# EAGLE design BigDigit (EAGLE 7.1.0)
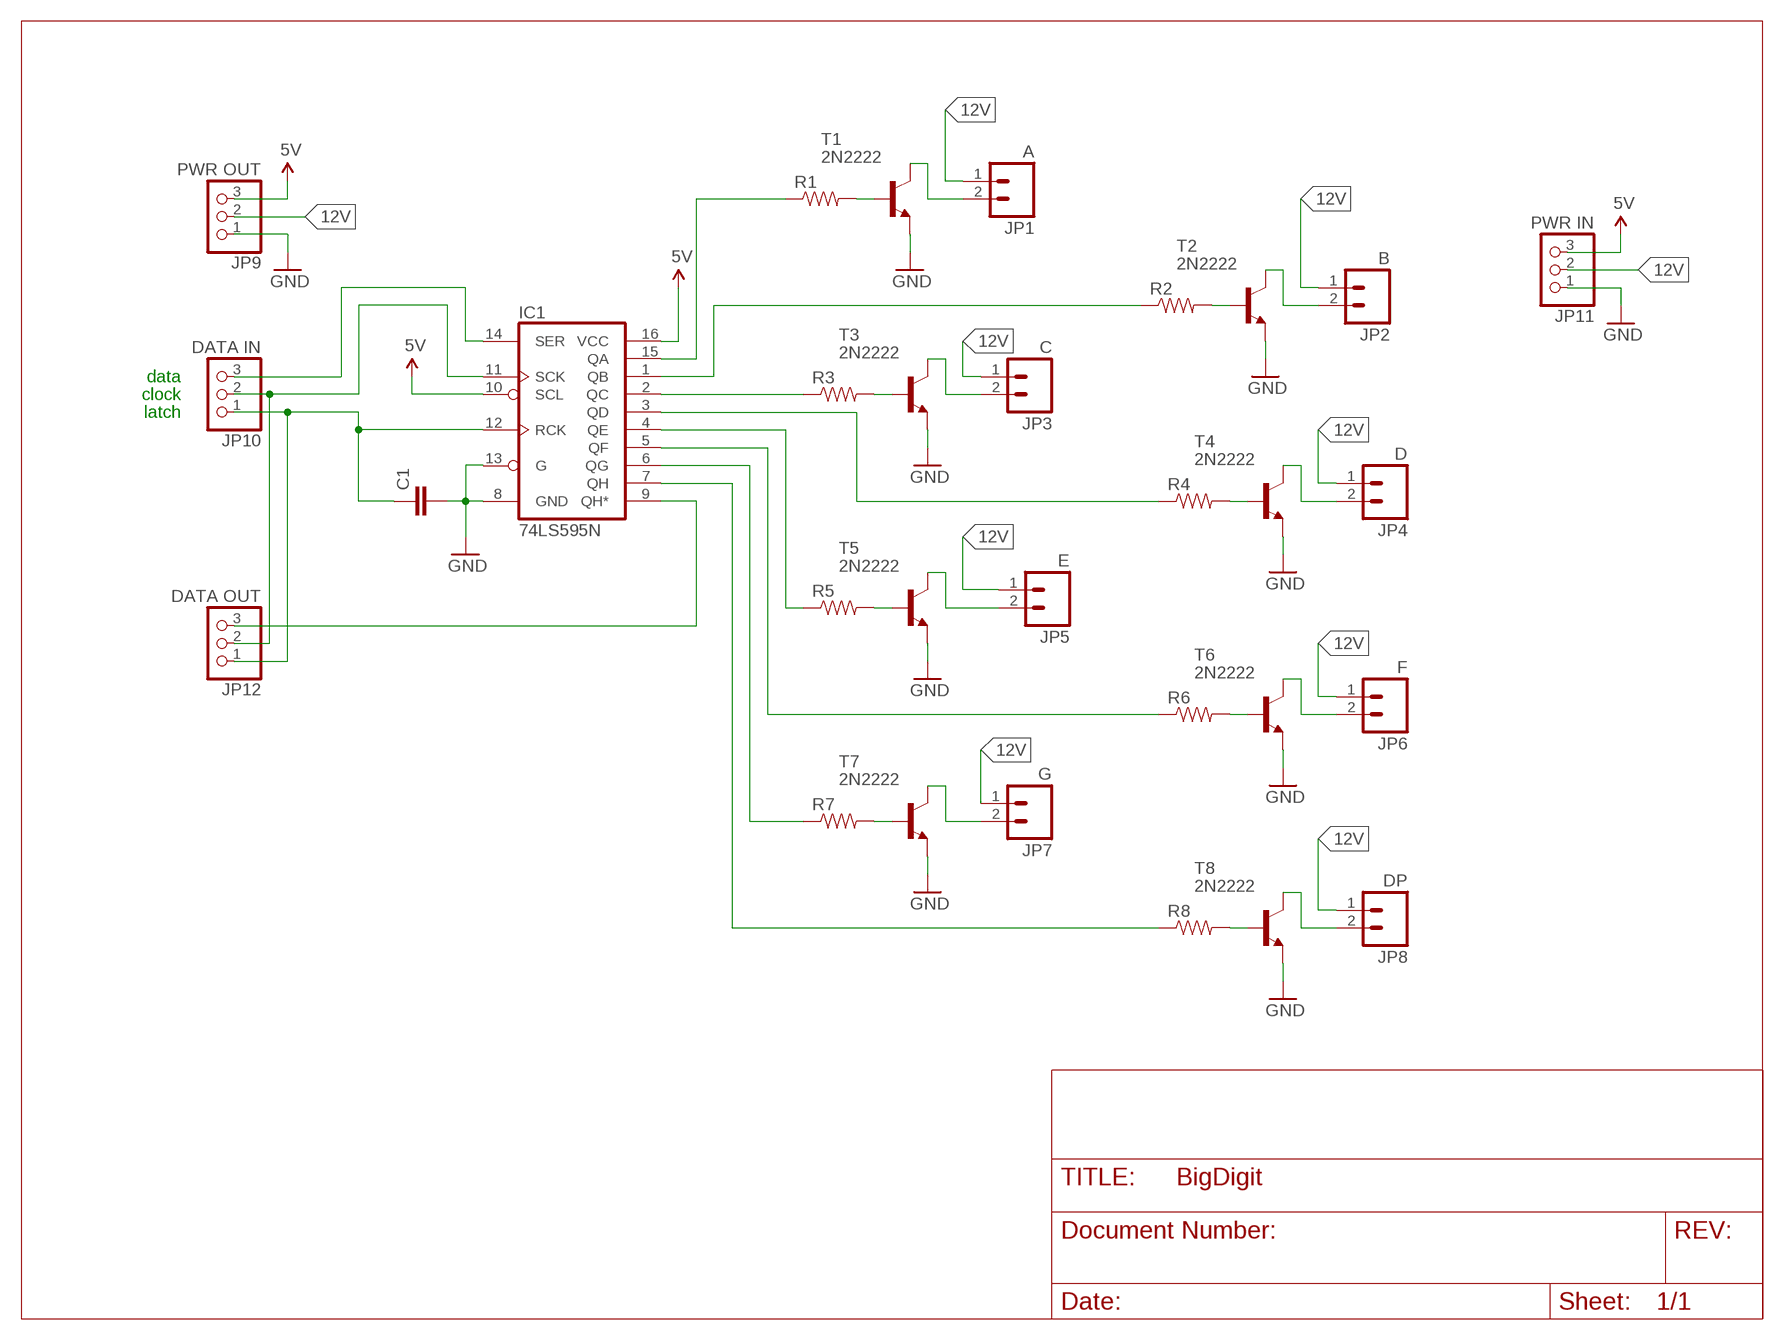
[diagram p0: schematic, sheet 1]

## Parts
C1  0.1UF-50V-20%(PTH)KIT-EZ  [CAP-PTH-SMALL-KIT]
IC1  74LS595N  [DIL16]
JP1  A  M02PTH  [1X02]
JP2  B  M02PTH  [1X02]
JP3  C  M02PTH  [1X02]
JP4  D  M02PTH  [1X02]
JP5  E  M02PTH  [1X02]
JP6  F  M02PTH  [1X02]
JP7  G  M02PTH  [1X02]
JP8  DP  M02PTH  [1X02]
JP9  PWR OUT  PINHD-1X3CB  [1X03-CLEANBIG]
JP10  DATA IN  PINHD-1X3CB  [1X03-CLEANBIG]
JP11  PWR IN  PINHD-1X3CB  [1X03-CLEANBIG]
JP12  DATA OUT  PINHD-1X3CB  [1X03-CLEANBIG]
R1  RESISTORPTH-1/4W-VERT  [AXIAL-0.1]
R2  RESISTORPTH-1/4W-VERT  [AXIAL-0.1]
R3  RESISTORPTH-1/4W-VERT  [AXIAL-0.1]
R4  RESISTORPTH-1/4W-VERT  [AXIAL-0.1]
R5  RESISTORPTH-1/4W-VERT  [AXIAL-0.1]
R6  RESISTORPTH-1/4W-VERT  [AXIAL-0.1]
R7  RESISTORPTH-1/4W-VERT  [AXIAL-0.1]
R8  RESISTORPTH-1/4W-VERT  [AXIAL-0.1]
T1  2N2222  [TO92-EBC-OVAL]
T2  2N2222  [TO92-EBC-OVAL]
T3  2N2222  [TO92-EBC-OVAL]
T4  2N2222  [TO92-EBC-OVAL]
T5  2N2222  [TO92-EBC-OVAL]
T6  2N2222  [TO92-EBC-OVAL]
T7  2N2222  [TO92-EBC-OVAL]
T8  2N2222  [TO92-EBC-OVAL]

## Nets
5V: IC1.10(SCL) IC1.16(VCC) JP9.3 JP11.3
12V: JP1.1 JP2.1 JP3.1 JP4.1 JP5.1 JP6.1 JP7.1 JP8.1 JP9.2 JP11.2
GND: C1.2 IC1.8(GND) IC1.13(G) JP9.1 JP11.1 T1.E T2.E T3.E T4.E T5.E T6.E T7.E T8.E
N$1: IC1.15(QA) R1.P$1
N$2: R1.P$2 T1.B
N$4: R5.P$2 T5.B
N$5: R3.P$2 T3.B
N$6: JP3.2 T3.C
N$7: JP5.2 T5.C
N$8: R7.P$2 T7.B
N$9: JP7.2 T7.C
N$10: IC1.1(QB) R2.P$1
N$11: R2.P$2 T2.B
N$12: JP2.2 T2.C
N$13: R4.P$2 T4.B
N$14: JP4.2 T4.C
N$15: R6.P$2 T6.B
N$16: JP6.2 T6.C
N$17: R8.P$2 T8.B
N$18: JP8.2 T8.C
N$19: IC1.2(QC) R3.P$1
N$20: IC1.3(QD) R4.P$1
N$21: IC1.4(QE) R5.P$1
N$22: IC1.5(QF) R6.P$1
N$23: IC1.6(QG) R7.P$1
N$24: IC1.7(QH) R8.P$1
N$25: JP1.2 T1.C
N$26: IC1.14(SER) JP10.3
N$27: IC1.11(SCK) JP10.2 JP12.2
N$28: C1.1 IC1.12(RCK) JP10.1 JP12.1
N$29: IC1.9(QH*) JP12.3

## Notes on the sheet
- data
- clock
- latch

## Library data of the parts
C1 = SparkFun-Capacitors:0.1UF-50V-20%(PTH): CAP-08370; PROD_ID: CAP-08370
IC1 = SparkFun-DigitalIC:74*595: 8-bit SHIFT REGISTER, output latch
JP1-JP8 = SparkFun-Connectors:M02: Standard 2-pin 0.1" header. Use with - straight break away headers ( PRT-00116) - right angle break away headers (PRT-00553) - swiss pins (PRT-00743) - machine pins (PRT-00117) - female headers (PRT-00115) Molex polarized connector foot print use with: PRT-08233 with associated crimp pins and housings. 2.54_SCREWTERM for use with PRT-10571. 3.5mm Screw Terminal footprints for PRT-08084 5mm Screw Terminal footprints for use with PRT-08433
JP9-JP12 = adafruit:PINHD-1X3: PIN HEADER
R1-R8 = SparkFun-Resistors:RESISTOR: Resistor Basic schematic elements and footprints for 0603, 1206, and PTH resistors.
T1-T8 = adafruit:2N2222: NPN TRANSISTOR Big oval pads

## Board
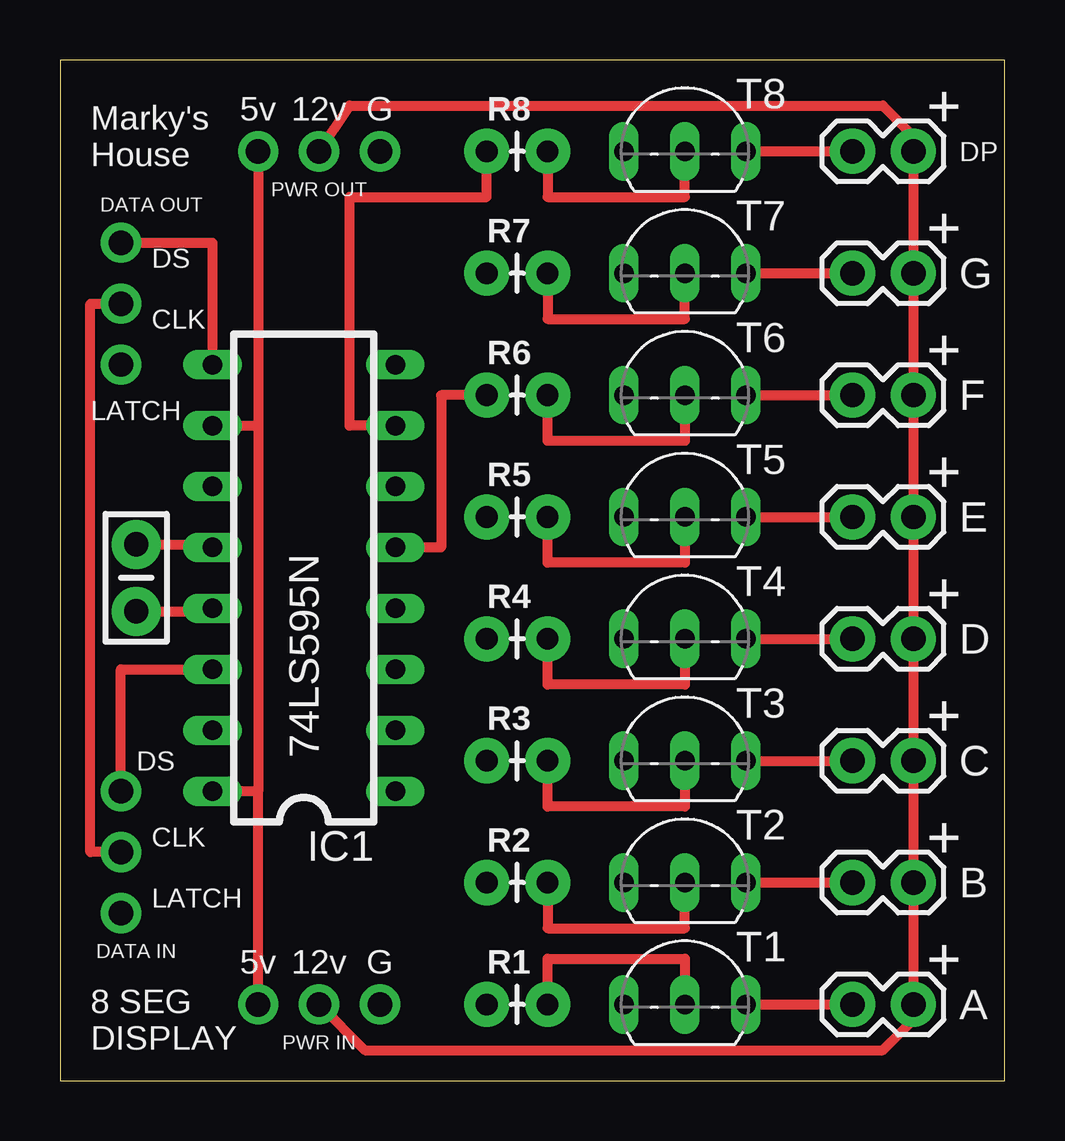
[diagram p1: board, top side]
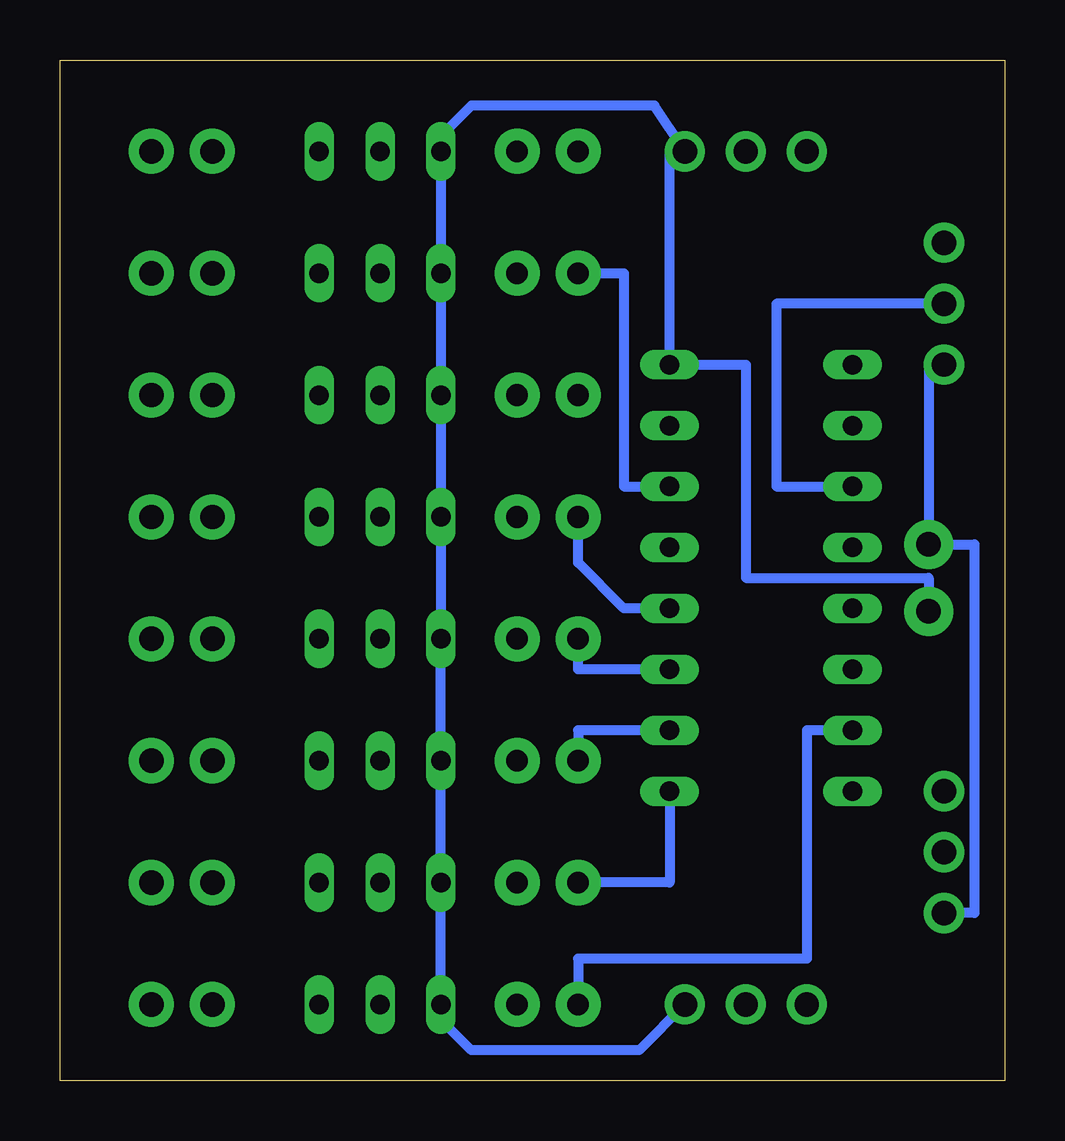
[diagram p2: board, bottom side, seen from below]

Size 39.37 x 42.55 mm. Coordinates in mm from the lower left corner, seen from the top.
Outline: 0,0 39.37,0 39.37,42.55 0,42.55 0,0
Copper layers (1*16): Top 0.0356mm / dielectric 1.5011mm / Bottom 0.0356mm
Design rules "LaenPCBOrder": minimum track width 6mil, minimum drill 13mil, track to track 6mil, track to pad 6mil, pad to pad 6mil, via to via 6mil, smd to smd 6mil, copper to edge 15mil, drill to drill 6mil, minimum pad ring 7mil, minimum via ring 7mil, stop-mask expansion 3mil, vias tented up to drill 0mil, thermal gap 10mil

### Footprints (pad centres in the part's own frame; a part is rotated, then mirrored left to right if it is on the bottom)
CAP-PTH-SMALL-KIT = drill 1.016 pad 2.032: 1 -1.397,0; 2 1.397,0
DIL16 = drill 0.813 long: 1 -8.89,-3.81; 2 -6.35,-3.81; 3 -3.81,-3.81; 4 -1.27,-3.81; 5 1.27,-3.81; 6 3.81,-3.81; 7 6.35,-3.81; 8 8.89,-3.81; 9 8.89,3.81; 10 6.35,3.81; 11 3.81,3.81; 12 1.27,3.81; 13 -1.27,3.81; 14 -3.81,3.81; 15 -6.35,3.81; 16 -8.89,3.81
1X02 = drill 1.016 pad 1.88: 1 0,0; 2 2.54,0
1X03-CLEANBIG = drill 1.016 pad 1.676: 1 -2.54,0; 2 0,0; 3 2.54,0
AXIAL-0.1 = drill 0.9 pad 1.88: P$1 0,0; P$2 2.54,0
TO92-EBC-OVAL = drill 0.813 long: B 0,-1.27; C 2.54,-1.27; E -2.54,-1.27

### Placement (x,y rotation side)
C1  3.17,20.95 270 top
IC1  10.16,20.95 90 top
JP1  35.56,3.17 180 top
JP2  35.56,8.26 180 top
JP3  35.56,13.34 180 top
JP4  35.56,18.41 180 top
JP5  35.56,23.5 180 top
JP6  35.56,28.57 180 top
JP7  35.56,33.66 180 top
JP8  35.56,38.73 180 top
JP9  10.79,38.73 180 top
JP10  2.54,9.53 90 top
JP11  10.79,3.17 180 top
JP12  2.54,32.38 90 top
R1  17.78,3.17 0 top
R2  17.78,8.26 0 top
R3  17.78,13.34 0 top
R4  17.78,18.41 0 top
R5  17.78,23.5 0 top
R6  17.78,28.57 0 top
R7  17.78,33.66 0 top
R8  17.78,38.73 0 top
T1  26.04,4.45 0 top
T2  26.04,9.53 0 top
T3  26.04,14.61 0 top
T4  26.04,19.68 0 top
T5  26.04,24.77 0 top
T6  26.04,29.84 0 top
T7  26.04,34.92 0 top
T8  26.04,40.01 0 top

### Tracks (layer width: path | path; a pad name or v marks a point on that pad's centre or on a via)
5V
  Top 0.406: JP11.3 8.26,12.06 | 8.26,12.06 IC1.16 | JP9.3 8.26,27.3 | 8.26,27.3 8.26,12.06 | IC1.10 8.26,27.3
12V
  Top 0.406: JP9.2 12.06,40.64 34.29,40.64 35.56,39.37 JP8.1 JP7.1 JP6.1 JP5.1 JP4.1 JP3.1 JP2.1 JP1.1 35.56,2.54 34.29,1.27 12.7,1.27 JP11.2
GND
  Top 0.406: C1.2 6.35,19.56 IC1.13
  Bottom 0.406: JP11.1 15.24,1.27 22.23,1.27 23.5,2.54 T1.E T2.E T3.E T4.E T5.E T6.E T7.E T8.E 23.5,39.37 22.23,40.64 14.61,40.64 JP9.1 13.97,38.73 IC1.8 10.79,29.84 10.79,20.95 3.17,20.95 C1.2
N$1
  Bottom 0.406: IC1.15 8.26,14.61 8.26,5.08 17.78,5.08 R1.P$1
N$2
  Top 0.406: R1.P$2 20.32,5.08 26.04,5.08 T1.B
N$4
  Top 0.406: T5.B 26.04,21.59 20.32,21.59 R5.P$2
N$5
  Top 0.406: T3.B 26.04,11.43 20.32,11.43 R3.P$2
N$6
  Top 0.406: T3.C JP3.2
N$7
  Top 0.406: T5.C JP5.2
N$8
  Top 0.406: R7.P$2 20.32,31.75 26.04,31.75 T7.B
N$9
  Top 0.406: T7.C JP7.2
N$10
  Bottom 0.406: IC1.1 13.97,8.26 R2.P$1
N$11
  Top 0.406: R2.P$2 20.32,6.35 26.04,6.35 T2.B
N$12
  Top 0.406: T2.C JP2.2
N$13
  Top 0.406: T4.B 26.04,16.51 20.32,16.51 R4.P$2
N$14
  Top 0.406: T4.C JP4.2
N$15
  Top 0.406: T6.B 26.04,26.67 20.32,26.67 R6.P$2
N$16
  Top 0.406: T6.C JP6.2
N$17
  Top 0.406: R8.P$2 20.32,36.83 26.04,36.83 T8.B
N$18
  Top 0.406: T8.C JP8.2
N$19
  Bottom 0.406: IC1.2 17.78,14.61 R3.P$1
N$20
  Bottom 0.406: IC1.3 17.78,17.14 R4.P$1
N$21
  Bottom 0.406: IC1.4 15.88,19.68 17.78,21.59 R5.P$1
N$22
  Top 0.406: R6.P$1 15.88,28.57 15.88,22.23 IC1.5
N$23
  Bottom 0.406: R7.P$1 15.88,33.66 15.88,24.77 IC1.6
N$24
  Top 0.406: IC1.7 12.06,27.3 12.06,36.83 17.78,36.83 R8.P$1
N$25
  Top 0.406: T1.C JP1.2
N$26
  Top 0.406: JP10.3 2.54,17.14 IC1.14
N$27
  Top 0.406: JP10.2 1.27,9.53 1.27,32.38 JP12.2
  Bottom 0.406: JP12.2 9.53,32.38 9.53,24.77 IC1.11
N$28
  Top 0.406: C1.1 6.35,22.35 IC1.12
  Bottom 0.406: JP12.1 3.17,29.84 C1.1 1.27,22.35 1.27,6.99 JP10.1
N$29
  Top 0.406: JP12.3 6.35,34.92 IC1.9

### Text on the board
tNames: + | 5v | 12v | G | Marky's / House | + | DS | CLK | + | LATCH | + | + | + | DS | CLK | + | LATCH | + | 5v | 12v | G | 8 SEG / DISPLAY